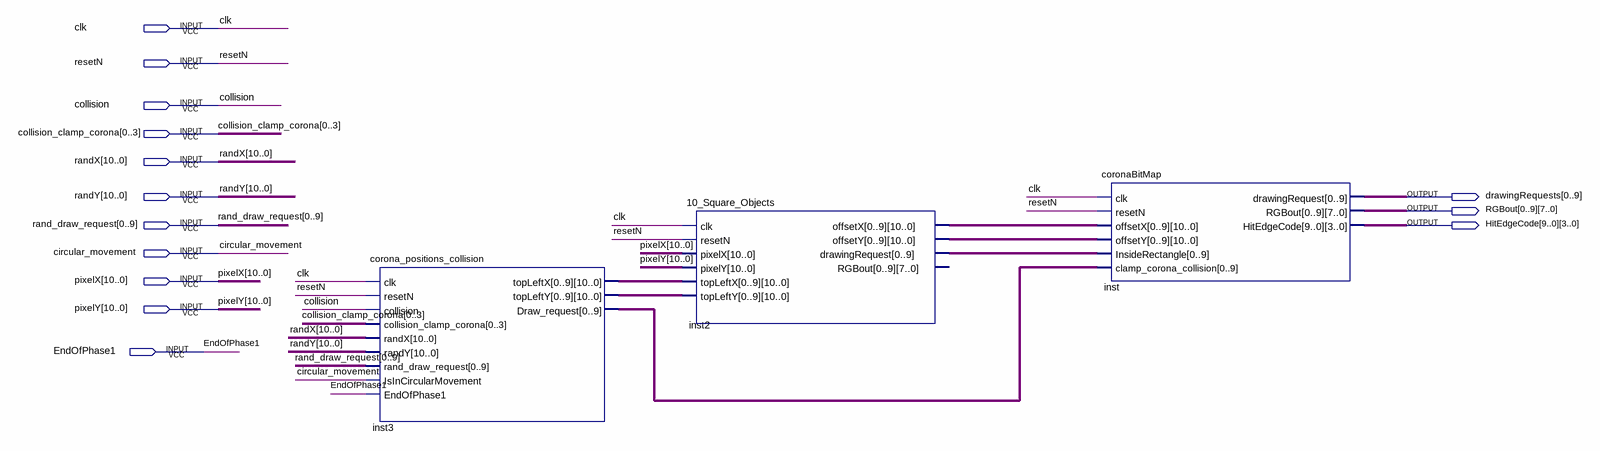
[diagram p0: schematic sheet]
// Quartus schematic corona_Block.bdf as structural Verilog: 3 symbols, 14 pins
module corona_Block (
  input  clk,
  input  resetN,
  input  collision,
  input  [0:3] collision_clamp_corona,
  input  [10:0] randX,
  input  [10:0] randY,
  input  [0:9] rand_draw_request,
  input  circular_movement,
  input  [10:0] pixelX,
  input  [10:0] pixelY,
  input  EndOfPhase1,
  output [0:9] drawingRequests,
  output [7:0] RGBout_0,
  output [7:0] RGBout_1,
  output [7:0] RGBout_2,
  output [7:0] RGBout_3,
  output [7:0] RGBout_4,
  output [7:0] RGBout_5,
  output [7:0] RGBout_6,
  output [7:0] RGBout_7,
  output [7:0] RGBout_8,
  output [7:0] RGBout_9,
  output [3:0] HitEdgeCode_9,
  output [3:0] HitEdgeCode_8,
  output [3:0] HitEdgeCode_7,
  output [3:0] HitEdgeCode_6,
  output [3:0] HitEdgeCode_5,
  output [3:0] HitEdgeCode_4,
  output [3:0] HitEdgeCode_3,
  output [3:0] HitEdgeCode_2,
  output [3:0] HitEdgeCode_1,
  output [3:0] HitEdgeCode_0
);

  wire [9:0] inst2_drawingrequest, inst3_draw_request;
  wire [109:0] inst2_offsetx, inst2_offsety, inst3_topleftx, inst3_toplefty;

  corona_positions_collision inst3 (
    .clk(clk), .resetN(resetN), .collision(collision), .collision_clamp_corona(collision_clamp_corona),
    .randX(randX), .randY(randY), .rand_draw_request(rand_draw_request),
    .IsInCircularMovement(circular_movement), .EndOfPhase1(EndOfPhase1), .topLeftX(inst3_topleftx),
    .topLeftY(inst3_toplefty), .Draw_request(inst3_draw_request));
  \10_Square_Objects  inst2 (
    .clk(clk), .resetN(resetN), .pixelX(pixelX), .pixelY(pixelY), .topLeftX(inst3_topleftx),
    .topLeftY(inst3_toplefty), .offsetX(inst2_offsetx), .offsetY(inst2_offsety),
    .drawingRequest(inst2_drawingrequest));  // open: RGBout
  coronaBitMap inst (
    .clk(clk), .resetN(resetN), .offsetX(inst2_offsetx), .offsetY(inst2_offsety),
    .InsideRectangle(inst2_drawingrequest), .clamp_corona_collision(inst3_draw_request),
    .drawingRequest(drawingRequests),
    .RGBout({RGBout_0, RGBout_1, RGBout_2, RGBout_3, RGBout_4, RGBout_5, RGBout_6, RGBout_7, RGBout_8, RGBout_9}),
    .HitEdgeCode({HitEdgeCode_9, HitEdgeCode_8, HitEdgeCode_7, HitEdgeCode_6, HitEdgeCode_5, HitEdgeCode_4, HitEdgeCode_3, HitEdgeCode_2, HitEdgeCode_1, HitEdgeCode_0}));
endmodule
